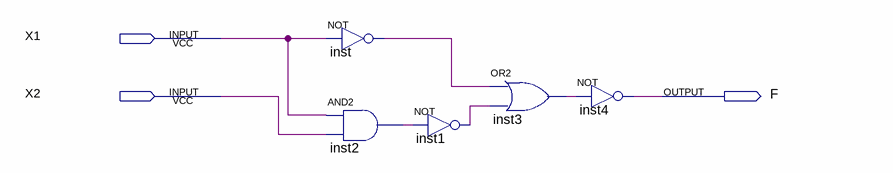
[diagram p0: schematic sheet]
// Quartus schematic EDWARD2.bdf as structural Verilog: 5 symbols, 3 pins
module EDWARD2 (
  input  X1,
  input  X2,
  output F
);

  wire inst1_out, inst2_out, inst3_out, inst_out;

  not inst (inst_out, X1);
  and inst2 (inst2_out, X1, X2);
  not inst1 (inst1_out, inst2_out);
  or inst3 (inst3_out, inst_out, inst1_out);
  not inst4 (F, inst3_out);
endmodule
